# Altium schematic sheet 显示及键盘电路symbol.SchDoc
size A4
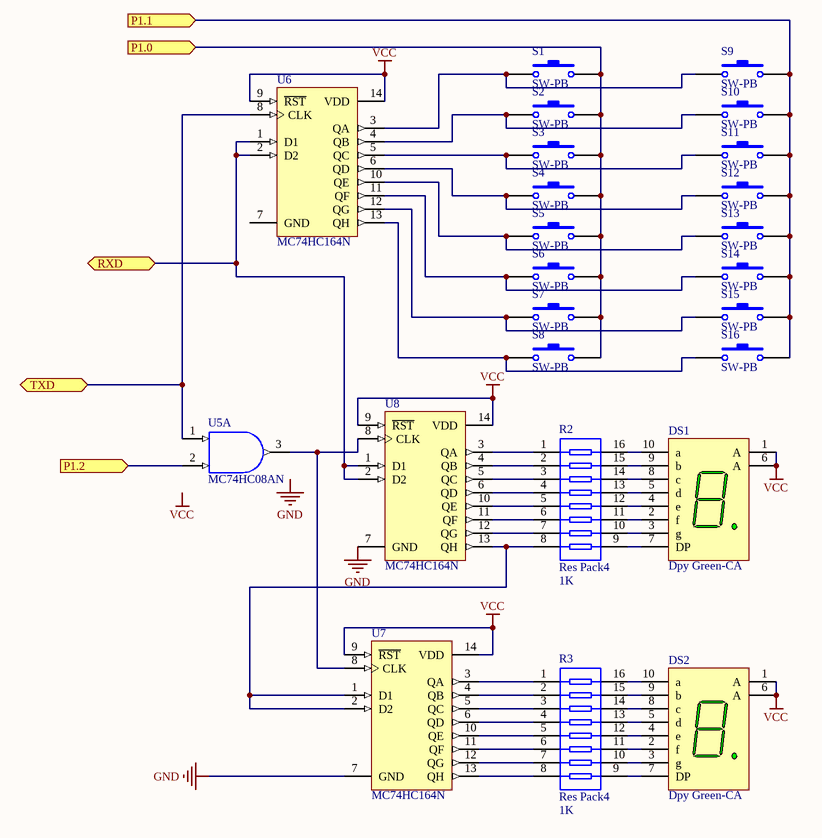
[diagram p0: 显示及键盘电路symbol.SchDoc]

## Parts
DS1  Dpy Green-CA  [A]
DS2  Dpy Green-CA  [A]
R2  Res Pack4  value 1K  [SSOP16_N]
R3  Res Pack4  value 1K  [SSOP16_N]
S1  SW-PB  [SPST-2]
S2  SW-PB  [SPST-2]
S3  SW-PB  [SPST-2]
S4  SW-PB  [SPST-2]
S5  SW-PB  [SPST-2]
S6  SW-PB  [SPST-2]
S7  SW-PB  [SPST-2]
S8  SW-PB  [SPST-2]
S9  SW-PB  [SPST-2]
S10  SW-PB  [SPST-2]
S11  SW-PB  [SPST-2]
S12  SW-PB  [SPST-2]
S13  SW-PB  [SPST-2]
S14  SW-PB  [SPST-2]
S15  SW-PB  [SPST-2]
S16  SW-PB  [SPST-2]
U5  MC74HC08AN  [646-06]  (part A of 4)
U6  MC74HC164N  [646-06]
U7  MC74HC164N  [646-06]
U8  MC74HC164N  [646-06]

## Ports
P1.0 (in), P1.1 (in), P1.2 (in), RXD (bidir), TXD (bidir)

## Nets
GND: U5.7(GND) U7.7(GND) U8.7(GND)
VCC: DS1.1(A) DS1.6(A) DS2.1(A) DS2.6(A) U5.14(VDD) U6.9(~{RST}) U6.14(VDD) U7.9(~{RST}) U7.14(VDD) U8.9(~{RST}) U8.14(VDD)
P1.0: S1.2 S2.2 S3.2 S4.2 S5.2 S6.2 S7.2 S8.2 ; port P1.0
P1.1: S9.2 S10.2 S11.2 S12.2 S13.2 S14.2 S15.2 S16.2 ; port P1.1
P1.2: U5.2(B) ; port P1.2
RXD: U6.1(D1) U6.2(D2) U8.1(D1) U8.2(D2) ; port RXD
TXD: U5.1(A) U6.8(CLK) ; port TXD
NetDS1_2: DS1.2(f) R2.11
NetDS1_3: DS1.3(g) R2.10
NetDS1_4: DS1.4(e) R2.12
NetDS1_5: DS1.5(d) R2.13
NetDS1_7: DS1.7(DP) R2.9
NetDS1_8: DS1.8(c) R2.14
NetDS1_9: DS1.9(b) R2.15
NetDS1_10: DS1.10(a) R2.16
NetDS2_2: DS2.2(f) R3.11
NetDS2_3: DS2.3(g) R3.10
NetDS2_4: DS2.4(e) R3.12
NetDS2_5: DS2.5(d) R3.13
NetDS2_7: DS2.7(DP) R3.9
NetDS2_8: DS2.8(c) R3.14
NetDS2_9: DS2.9(b) R3.15
NetDS2_10: DS2.10(a) R3.16
NetR2_1: R2.1 U8.3(QA)
NetR2_2: R2.2 U8.4(QB)
NetR2_3: R2.3 U8.5(QC)
NetR2_4: R2.4 U8.6(QD)
NetR2_5: R2.5 U8.10(QE)
NetR2_6: R2.6 U8.11(QF)
NetR2_7: R2.7 U8.12(QG)
NetR2_8: R2.8 U7.1(D1) U7.2(D2) U8.13(QH)
NetR3_1: R3.1 U7.3(QA)
NetR3_2: R3.2 U7.4(QB)
NetR3_3: R3.3 U7.5(QC)
NetR3_4: R3.4 U7.6(QD)
NetR3_5: R3.5 U7.10(QE)
NetR3_6: R3.6 U7.11(QF)
NetR3_7: R3.7 U7.12(QG)
NetR3_8: R3.8 U7.13(QH)
NetS1_1: S1.1 S9.1 U6.3(QA)
NetS2_1: S2.1 S10.1 U6.4(QB)
NetS3_1: S3.1 S11.1 U6.5(QC)
NetS4_1: S4.1 S12.1 U6.6(QD)
NetS5_1: S5.1 S13.1 U6.10(QE)
NetS6_1: S6.1 S14.1 U6.11(QF)
NetS7_1: S7.1 S15.1 U6.12(QG)
NetS8_1: S8.1 S16.1 U6.13(QH)
NetU5_3: U5.3(Y) U7.8(CLK) U8.8(CLK)

Not connected (* = marked no-connect by the designer): U6 7(GND)

## Notes on the sheet
- Labels drawn without touching a wire or pin: GND, VCC
- 专升本
- 通信工程
- 李烨攀
- 2101班
- 210806300163
- 学号

## Library data of the parts
DS1 DS2 = Dpy Green-CA: 7.62 mm Black Surface Green 7-Segment Display: CA, RH DP; MinimumIntensity: 860 ucd; Note: IF = 10 mA; Note: Pins 1 and 6 are redundant Anodes.; Published: 8-Jun-2000; LatestRevisionDate: 17-Dec-2003; LatestRevisionNote: Schematic revised, PCB Footprint replaced.; DatasheetVersion: 19-Feb-2002; PackageVersion: 11-Feb-2002; PackageReference: A; Publisher: Altium Limited; PackageDescription: LED, 7-Segment Display, 7.62 mm, RHD; 10 Leads; Row Space 5.08 mm; Pitch 2.54 mm; Colour: Green; ComponentLink1Description: Manufacturer Link; ComponentLink1URL: http://www.agilent.com/
R2 R3 = Res Pack4: Isolated Resistor Network; Published: 24-Mar-1999; LatestRevisionDate: 29-May-2009; LatestRevisionNote: IPC-7351 Footprint Added.; PackageVersion: Oct-2003; PackageReference: SSOP16; Publisher: Altium Limited; PackageDescription: 16-Pin Plastic Small Outline Package 0.65 mm Pitch; Code_JEDEC: MO-150-AC; Code_IPC: SOP65P780-16
S1-S16 = SW-PB: Switch; Published: 24-Mar-1999; LatestRevisionDate: 17-Jul-2002; LatestRevisionNote: Re-released for DXP Platform.; PackageReference: SPST-2; Publisher: Altium Limited; PackageDescription: Switch; 2 Leads
U5 = MC74HC08AN: Quad 2-Input AND Gate; Published: 17-Jul-2002; LatestRevisionDate: 06-Jun-2005; LatestRevisionNote: Stylized 3D Model Added; DatasheetVersion: 1989; PackageVersion: 1997; PackageReference: 646-06; Publisher: Altium Limited; PackageDescription: DIP; 14 Leads; Row Spacing 7.62 mm; Pitch 2.54 mm; ComponentLink1Description: Manufacturer Link; ComponentLink1URL: http://www.onsemi.com/site/products/parametrics/0,4446,247,00.html; ComponentLink2Description: Ibis Model; ComponentLink2URL: http://www.onsemi.com/pub/Collateral/MC54HC08AJ.IBS
U6-U8 = MC74HC164N: 8-Bit Serial-Input/Parallel-Output Shift Register; Published: 17-Jul-2002; LatestRevisionDate: 06-Jun-2005; LatestRevisionNote: Stylized 3D Model Added; DatasheetVersion: 1989; PackageVersion: 1997; PackageReference: 646-06; Publisher: Altium Limited; PackageDescription: DIP; 14 Leads; Row Spacing 7.62 mm; Pitch 2.54 mm; ComponentLink1Description: Manufacturer Link; ComponentLink1URL: http://www.onsemi.com/site/products/parametrics/0,4446,557,00.html